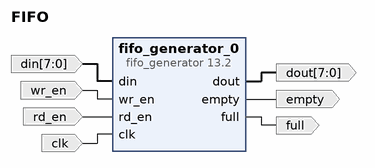
[diagram p0: block diagram of the top level]
# Vivado block design FIFO, xc7s25csga225-1, Vivado 2019.1
create_bd_design FIFO

create_bd_port -dir I -from 7 -to 0 -type data din
create_bd_port -dir I wr_en
create_bd_port -dir I rd_en
create_bd_port -dir I clk
create_bd_port -dir O -from 7 -to 0 -type data dout
create_bd_port -dir O empty
create_bd_port -dir O full

create_bd_cell -type ip -vlnv xilinx.com:ip:fifo_generator:13.2 fifo_generator_0
set_property -dict [list \
  CONFIG.Input_Data_Width 8 \
  CONFIG.Input_Depth 16384 \
  CONFIG.Output_Data_Width 8 \
  CONFIG.Reset_Pin false \
  CONFIG.Use_Embedded_Registers false \
] [get_bd_cells fifo_generator_0]

# ---- connections ----

connect_bd_net [get_bd_ports din] [get_bd_pins fifo_generator_0/din]
connect_bd_net [get_bd_ports wr_en] [get_bd_pins fifo_generator_0/wr_en]
connect_bd_net [get_bd_ports rd_en] [get_bd_pins fifo_generator_0/rd_en]
connect_bd_net [get_bd_ports clk] [get_bd_pins fifo_generator_0/clk]
connect_bd_net [get_bd_pins fifo_generator_0/dout] [get_bd_ports dout]
connect_bd_net [get_bd_pins fifo_generator_0/empty] [get_bd_ports empty]
connect_bd_net [get_bd_pins fifo_generator_0/full] [get_bd_ports full]

validate_bd_design
save_bd_design
